# Altium project Wiegand.PrjPcb
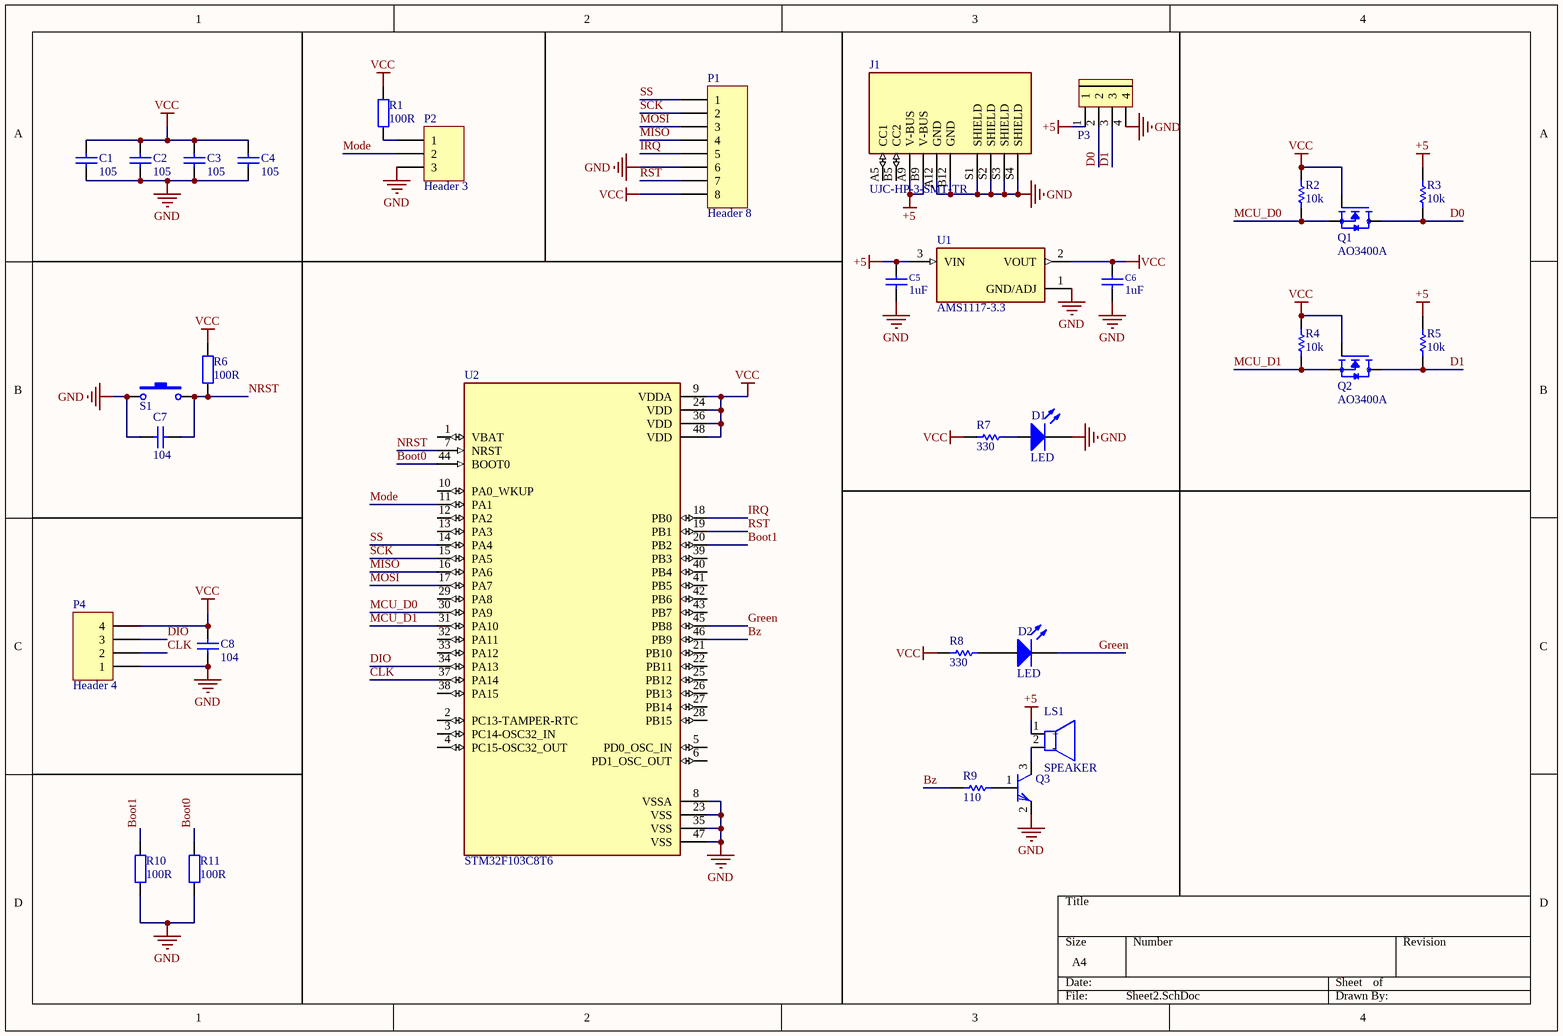
[diagram p0: Sheet2.SchDoc]
1 sheet, 33 parts. Net scope: global (net labels, ports and power ports of the same name join across sheets).
Board file: PCB2.PcbDoc

## Sheet Sheet2.SchDoc
size A4; SheetNumber: 1; SheetTotal: 1

### Parts
C1  value 105  [C-NP-0805]  (hidden comment: Cap Non-pol)
C2  value 105  [C-NP-0805]  (hidden comment: Cap Non-pol)
C3  value 105  [C-NP-0805]  (hidden comment: Cap Non-pol)
C4  value 105  [C-NP-0805]  (hidden comment: Cap Non-pol)
C5  1uF  [C2012-0805]
C6  1uF  [C2012-0805]
C7  value 104  [C-NP-0805]  (hidden comment: Cap Non-pol)
C8  value 104  [C-NP-0805]  (hidden comment: Cap Non-pol)
D1  LED  [LED-0805 RED]
D2  LED  [LED-0 3mm RED]
J1  UJC-HP-3-SMT-TR  [CUI_UJC-HP-3-SMT-TR]
LS1  SPEAKER  [speaker]
P1  Header 8  [Header 8]
P2  Header 3  [Header 3]
P3  BIG Header 4  [BIG_Header 4]  (value not drawn)
P4  Header 4  [Header 4]
Q1  AO3400A  [SOT95P280X125-3N]
Q2  AO3400A  [SOT95P280X125-3N]
Q3  C1815  [SOT23 [C1815]]  (value not drawn)
R1  value 100R  [DIEN TRO 0805]  (hidden comment: RES_SMD_0805)
R2  value 10k  [R-0805]  (hidden comment: RESISTOR)
R3  value 10k  [R-0805]  (hidden comment: RESISTOR)
R4  value 10k  [R-0805]  (hidden comment: RESISTOR)
R5  value 10k  [R-0805]  (hidden comment: RESISTOR)
R6  value 100R  [DIEN TRO 0805]  (hidden comment: RES_SMD_0805)
R7  value 330  [R-0805]  (hidden comment: RESISTOR)
R8  value 330  [R-0805]  (hidden comment: RESISTOR)
R9  value 110  [R-0805]  (hidden comment: RESISTOR)
R10  value 100R  [DIEN TRO 0805]  (hidden comment: RES_SMD_0805)
R11  value 100R  [DIEN TRO 0805]  (hidden comment: RES_SMD_0805)
S1  SW-SMD  [SW-SMD]  (value not drawn)
U1  AMS1117-3.3  [SOT229P700X180-4N]
U2  STM32F103C8T6  [QFP50P900X900X160-48N]

### Nets
+5: C5.2 J1.A9(V-BUS) J1.B9(V-BUS) LS1.1(+) P3.1 R3.2 R5.2 U1.3(VIN)
GND: C1.1 C2.1 C3.1 C4.1 C5.1 C6.2 C7.2 C8.2 D1.2(K) J1.A12(GND) J1.B12(GND) J1.S1(SHIELD) J1.S2(SHIELD) J1.S3(SHIELD) J1.S4(SHIELD) P1.6 P2.3 P3.4 P4.1 Q3.2(E) R10.2 R11.1 S1.1 U1.1(GND/ADJ) U2.8(VSSA) U2.23(VSS) U2.35(VSS) U2.47(VSS)
VCC: C1.2 C2.2 C3.2 C4.2 C6.1 C8.1 P1.8 P4.4 Q1.1(G) Q2.1(G) R1.2 R2.2 R4.2 R6.2 R7.1 R8.1 U1.2(VOUT) U2.9(VDDA) U2.24(VDD) U2.36(VDD) U2.48(VDD)
Boot0: R11.2 U2.44(BOOT0)
Boot1: R10.1 U2.20(PB2)
Bz: R9.1 U2.46(PB9)
CLK: P4.2 U2.37(PA14)
D0: P3.2 Q1.3(D) R3.1
D1: P3.3 Q2.3(D) R5.1
DIO: P4.3 U2.34(PA13)
Green: D2.2(K) U2.45(PB8)
IRQ: P1.5 U2.18(PB0)
MCU_D0: Q1.2(S) R2.1 U2.30(PA9)
MCU_D1: Q2.2(S) R4.1 U2.31(PA10)
MISO: P1.4 U2.16(PA6)
Mode: P2.2 U2.11(PA1)
MOSI: P1.3 U2.17(PA7)
NRST: C7.1 R6.1 S1.2 U2.7(NRST)
RST: P1.7 U2.19(PB1)
SCK: P1.2 U2.15(PA5)
SS: P1.1 U2.14(PA4)
NetD1_1: D1.1(A) R7.2
NetD2_1: D2.1(A) R8.2
NetLS1_2: LS1.2(-) Q3.3(C)
NetP2_1: P2.1 R1.1
NetQ3_1: Q3.1(B) R9.2

Not connected (* = marked no-connect by the designer): J1 A5(CC1) B5(CC2); U2 1(VBAT) 2(PC13-TAMPER-RTC) 3(PC14-OSC32_IN) 4(PC15-OSC32_OUT) 5(PD0_OSC_IN) 6(PD1_OSC_OUT) 10(PA0_WKUP) 12(PA2) 13(PA3) 21(PB10) 22(PB11) 25(PB12) 26(PB13) 27(PB14) 28(PB15) 29(PA8) 32(PA11) 33(PA12) 38(PA15) 39(PB3) 40(PB4) 41(PB5) 42(PB6) 43(PB7)

### Library data of the parts
C1-C4 C7 C8 = Cap Non-pol: Non-polarized Capacitor; Published: 8-Jun-2000; LatestRevisionDate: 17-Jul-2002; LatestRevisionNote: Re-released for DXP Platform.; PackageReference: RAD-0.3; Publisher: Altium Limited
C5 C6 = Capacitor: AEMS Code: 2100341; Vendor: Digikey; Volt: 16V; Published: 13-April-2009; Publisher: Hoang Nguyen; ComponentLink1Description: Digikey Part Link; ComponentLink2Description: Open Datasheet; ComponentLink2URL: H:\LIBRARY\LIBRARY.Datasheet\; Value: 1uF
D1 D2 = LED: Typical LED; Published: 8-Jun-2000; LatestRevisionDate: 08-Jul-2005; LatestRevisionNote: Mech Layer 1 removed.; PackageReference: LED-1; Publisher: Altium Limited
LS1 = SPEAKER: Vendor: Digikey; Published: 13-April-2009; Publisher: Hoang Nguyen; ComponentLink1Description: Digikey Part Link; ComponentLink2Description: Open Datasheet; ComponentLink2URL: H:\LIBRARY\LIBRARY.Datasheet\
P1 = Header 8: Header, 8-Pin; LatestRevisionDate: 17-Jul-2002; LatestRevisionNote: Re-released for DXP Platform.; Publisher: Altium Limited
P2 = Header 3: Header, 3-Pin; LatestRevisionDate: 17-Jul-2002; LatestRevisionNote: Re-released for DXP Platform.; Publisher: Altium Limited
P3 = BIG_Header 4
P4 = Header 4: Header, 4-Pin; LatestRevisionDate: 17-Jul-2002; LatestRevisionNote: Re-released for DXP Platform.; Publisher: Altium Limited
Q1 Q2 = AO3400A: Trans MOSFET N-CH 30V 5.7A 3-Pin SOT-23; Package: None; Price: None; Availability: Unavailable; MP: AO3400A; Value: *
Q3 = C1815: Q2SC1815; PSpiceTemplate: Q^@REFDES %c %b %e @MODEL; Vendor: Digikey; COMPONENT: 2SC1815; Published: 13-April-2009; Publisher: Hoang Nguyen; ComponentLink1Description: Digikey Part Link; ComponentLink2Description: Open Datasheet; ComponentLink2URL: H:\LIBRARY\LIBRARY.Datasheet\; Price: 500VND
R1 R6 R10 R11 = RES_SMD_0805: RES_0805; Published: 8-Jun-2000; LatestRevisionDate: 17-Jul-2002; LatestRevisionNote: Re-released for DXP Platform.; PackageReference: AXIAL-0.4; Publisher: Altium Limited
S1 = SW-SMD: Switch; Published: 24-Mar-1999; LatestRevisionDate: 17-Jul-2002; LatestRevisionNote: Re-released for DXP Platform.; PackageReference: SPST-2; Publisher: Altium Limited
U1 = AMS1117-3.3: Sot223/Pkg 1-Amp 3.3-Volt Low Drop Out Voltage Regulatator; MF: Advanced Monolithic Systems; Package: SOT-223 Seeed Technology; Value: *; Check_prices: https://www.snapeda.com/parts/AMS1117-3.3/Advanced+Monolithic+Systems/view-part/?ref=eda; Price: None; Availability: Not in stock; MP: AMS1117-3.3; SnapEDA_Link: https://www.snapeda.com/parts/AMS1117-3.3/Advanced+Monolithic+Systems/view-part/?ref=snap
U2 = STM32F103C8T6: ARM® Cortex®-M3 STM32F1 Microcontroller IC 32-Bit 72MHz 64KB (64K x 8) FLASH 48-LQFP (7x7); MF: STMicroelectronics; SnapEDA_Link: https://www.snapeda.com/parts/STM32F103C8T6/STMicroelectronics/view-part/?ref=snap; Package: LQFP-48 STMicroelectronics; Value: *; MP: STM32F103C8T6; Check_prices: https://www.snapeda.com/parts/STM32F103C8T6/STMicroelectronics/view-part/?ref=eda
J1 = UJC-HP-3-SMT-TR: Package: None; Price: None; Value: *; MP: UJC-HP-3-SMT-TR; Availability: Unavailable
R2-R5 R7-R9 = RESISTOR: Published: 8-Jun-2000; LatestRevisionDate: 17-Jul-2002; LatestRevisionNote: Re-released for DXP Platform.; PackageReference: AXIAL-0.3; Publisher: Altium Limited